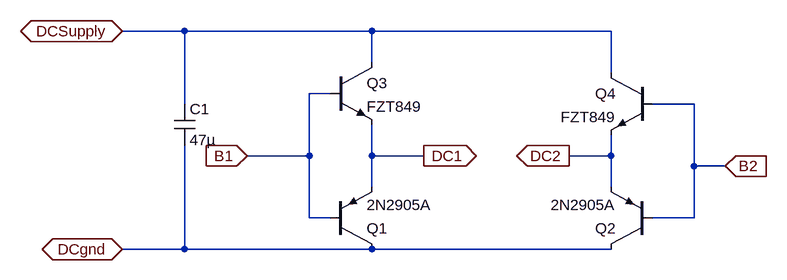
[diagram p0: schematic H_brdige.asc]
H_brdige.asc, the LTspice schematic file:
Version 4
SHEET 1 880 680
WIRE -208 -48 -304 -48
WIRE 80 -48 -208 -48
WIRE 448 -48 80 -48
WIRE 80 0 80 -48
WIRE 448 16 448 -48
WIRE 16 48 -16 48
WIRE -208 64 -208 -48
WIRE 576 64 512 64
WIRE -16 144 -16 48
WIRE -16 144 -112 144
WIRE 80 144 80 96
WIRE 160 144 80 144
WIRE 448 144 448 112
WIRE 448 144 384 144
WIRE 576 160 576 64
WIRE 624 160 576 160
WIRE 80 192 80 144
WIRE 448 192 448 144
WIRE -16 240 -16 144
WIRE 16 240 -16 240
WIRE 576 240 576 160
WIRE 576 240 512 240
WIRE -208 288 -208 128
WIRE -208 288 -304 288
WIRE 80 288 -208 288
WIRE 448 288 80 288
FLAG -304 -48 DCSupply
IOPIN -304 -48 BiDir
FLAG -304 288 DCgnd
IOPIN -304 288 BiDir
FLAG -112 144 B1
IOPIN -112 144 In
FLAG 624 160 B2
IOPIN 624 160 In
FLAG 160 144 DC1
IOPIN 160 144 Out
FLAG 384 144 DC2
IOPIN 384 144 Out
SYMBOL LTSpice-Libraries-master\\LTSpice-Libraries-master\\sym\\pnp 16 288 M180
SYMATTR InstName Q1
SYMATTR Value 2N2905A
SYMBOL LTSpice-Libraries-master\\LTSpice-Libraries-master\\sym\\pnp 512 288 R180
SYMATTR InstName Q2
SYMATTR Value 2N2905A
SYMBOL LTSpice-Libraries-master\\LTSpice-Libraries-master\\sym\\npn 16 0 R0
SYMATTR InstName Q3
SYMATTR Value FZT849
SYMBOL LTSpice-Libraries-master\\LTSpice-Libraries-master\\sym\\npn 512 16 M0
SYMATTR InstName Q4
SYMATTR Value FZT849
SYMBOL cap -224 64 R0
SYMATTR InstName C1
SYMATTR Value 47µ

The netlist it stands for:
* H_brdige.asc
Q1 DCgnd B1 DC1 0 2N2905A
Q2 DCgnd B2 DC2 0 2N2905A
Q3 DCSupply B1 DC1 0 FZT849
Q4 DCSupply B2 DC2 0 FZT849
C1 DCSupply DCgnd 47µ
.model NPN NPN
.model PNP PNP
.lib standard.bjt
.backanno
.end